# EAGLE schematic CNCMachineV1 (EAGLE 7.6.0)
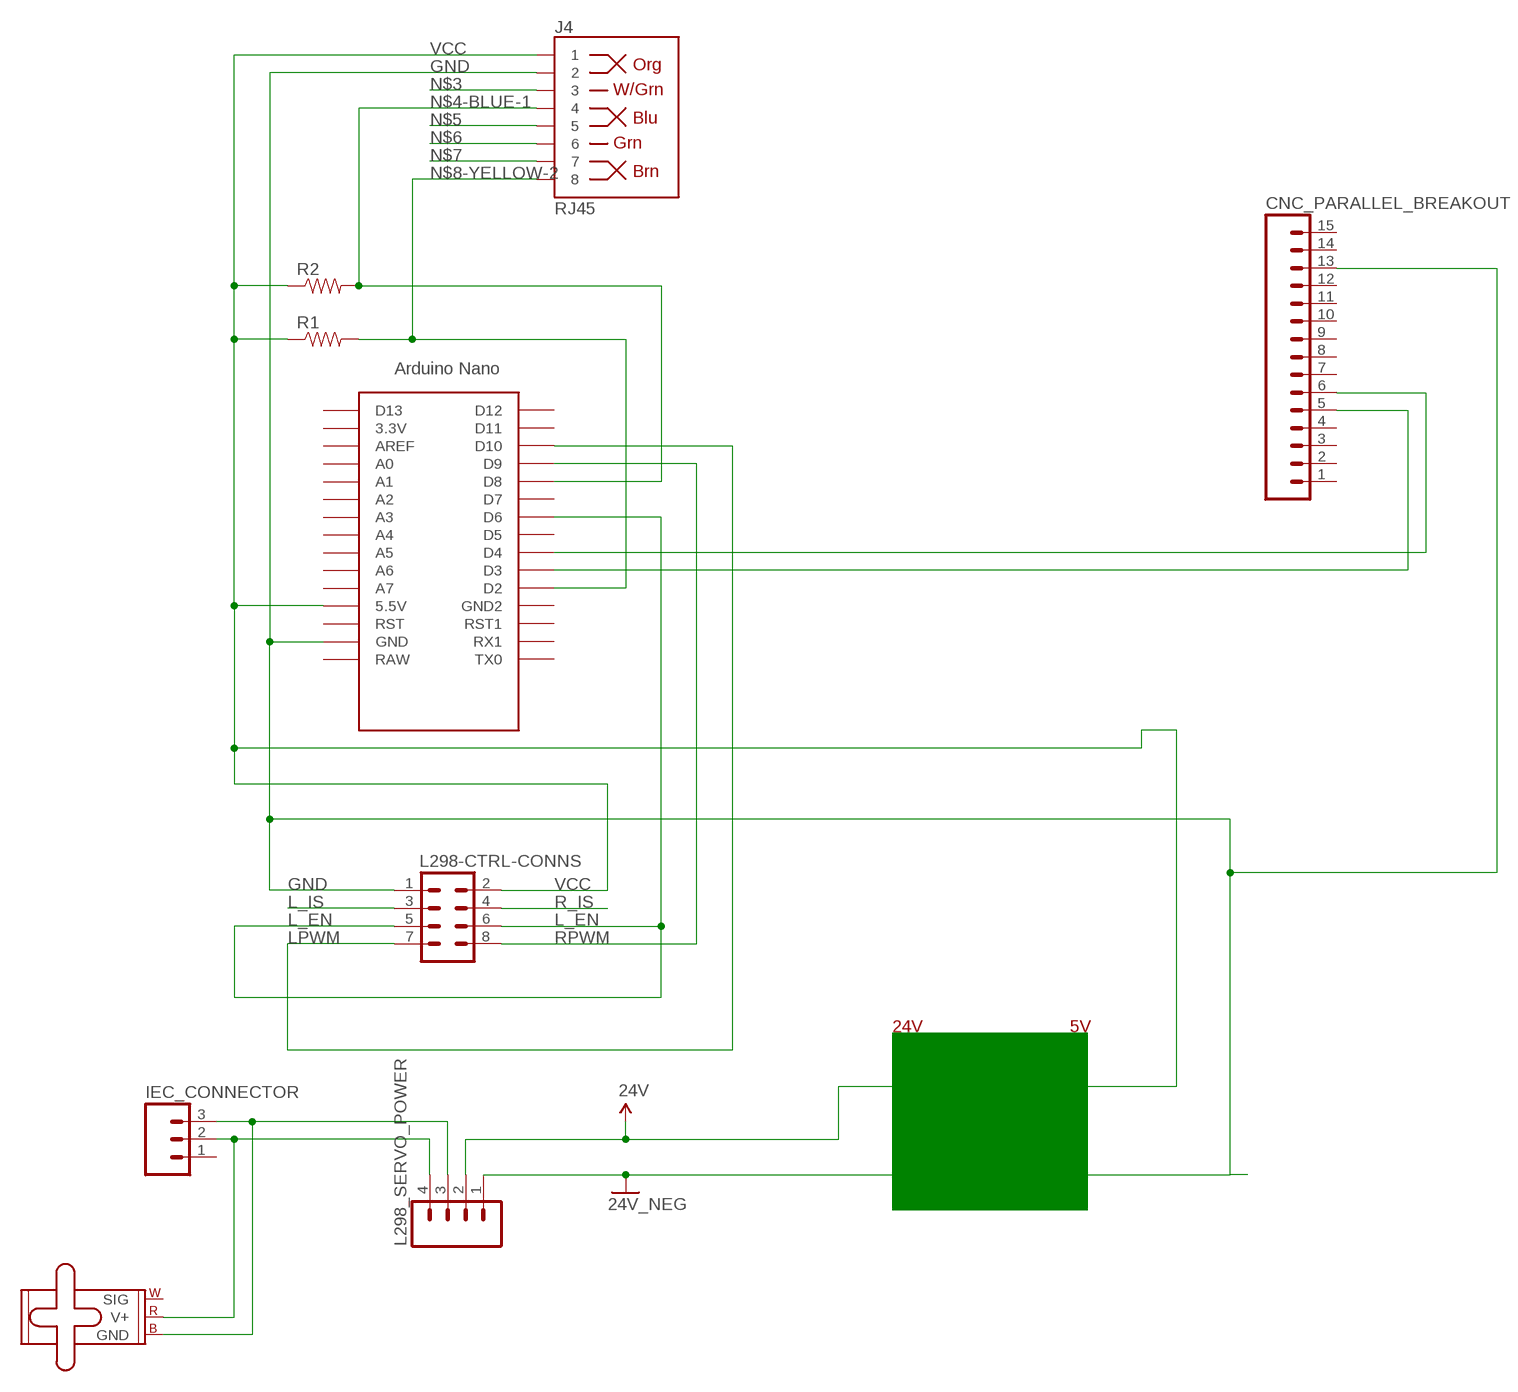
[diagram p0: schematic, sheet 1]

## Parts
CNC_PARALLEL_BREAKOUT  M15  [1X15]
IEC_CONNECTOR  M03-SCREW-5MM  [SCREWTERMINAL-5MM-3]
J4  RJ45  RJ45-8PTH  [RJ45-8]
L298-CTRL-CONNS  M04X2  [2X4]
L298_SERVO_POWER  M04SCREW  [SCREWTERMINAL-3.5MM-4]
M1  SMALL_SERVO  [1X03]
R1  RESISTORPTH-1/2W  [AXIAL-0.5]
R2  RESISTORPTH-1/2W  [AXIAL-0.5]
U$1  NANO  [NANO]

## Nets
GND: CNC_PARALLEL_BREAKOUT.13 J4.2 L298-CTRL-CONNS.1 L298_SERVO_POWER.1 U$1.GND ; supply symbol labelled 24V_NEG
L_EN: L298-CTRL-CONNS.5 L298-CTRL-CONNS.6 U$1.D6
L_IS: L298-CTRL-CONNS.3
LPWM: L298-CTRL-CONNS.7 U$1.D10
N$1: IEC_CONNECTOR.2 L298_SERVO_POWER.4 M1.2(V+)
N$2: IEC_CONNECTOR.3 L298_SERVO_POWER.3 M1.3(GND)
N$3: J4.3
N$4: CNC_PARALLEL_BREAKOUT.5 U$1.D3
N$4-BLUE-1: J4.4 R2.P$2 U$1.D8
N$5: J4.5
N$6: J4.6
N$7: J4.7
N$8: CNC_PARALLEL_BREAKOUT.6 U$1.D4
N$8-YELLOW-2: J4.8 R1.P$2 U$1.D2
R_IS: L298-CTRL-CONNS.4
RPWM: L298-CTRL-CONNS.8 U$1.D9
VCC: J4.1 L298-CTRL-CONNS.2 L298_SERVO_POWER.2 R1.P$1 R2.P$1 U$1.5V(5.5V) ; supply symbol labelled 24V
Unconnected: CNC_PARALLEL_BREAKOUT.1 CNC_PARALLEL_BREAKOUT.2 CNC_PARALLEL_BREAKOUT.3 CNC_PARALLEL_BREAKOUT.4 CNC_PARALLEL_BREAKOUT.7 CNC_PARALLEL_BREAKOUT.8 CNC_PARALLEL_BREAKOUT.9 CNC_PARALLEL_BREAKOUT.10 CNC_PARALLEL_BREAKOUT.11 CNC_PARALLEL_BREAKOUT.12 CNC_PARALLEL_BREAKOUT.14 CNC_PARALLEL_BREAKOUT.15 IEC_CONNECTOR.1 M1.1(SIG) U$1.3.3V U$1.A0 U$1.A1 U$1.A2 U$1.A3 U$1.A4 U$1.A5 U$1.A6 U$1.A7 U$1.AREF U$1.D5 U$1.D7 U$1.D11 U$1.D12 U$1.D13 U$1.GND1(GND2) U$1.ICSP1 U$1.ICSP2 U$1.ICSP3 U$1.ICSP4 U$1.ICSP5 U$1.ICSP6 U$1.RAW U$1.RST U$1.RST1 U$1.RX1 U$1.TX0

## Notes on the sheet
- 24V | 5V
- 24V | 24V | 24V | 24V | 24V

## Library data of the parts
CNC_PARALLEL_BREAKOUT = SparkFun-Connectors:M15: Header 15 Standard 15-pin 0.1" header. Use with straight break away headers (SKU : PRT-00116), right angle break away headers (PRT-00553), swiss pins (PRT-00743), machine pins (PRT-00117), and female headers (PRT-00115).
IEC_CONNECTOR = SparkFun-Connectors:M03: Header 3 Standard 3-pin 0.1" header. Use with straight break away headers (SKU : PRT-00116), right angle break away headers (PRT-00553), swiss pins (PRT-00743), machine pins (PRT-00117), and female headers (PRT-00115). Molex polarized connector foot print use with SKU : PRT-08232 with associated crimp pins and housings.; STOREFRONT_ID: PRT-08433
J4 = SparkFun-Connectors:RJ45-8: RJ45 Jack Simple RJ45, 8-pin connection - connector for common Cat5, Cat5e, and Cat6 Ethernet cables. Footprint not yet proven in production. Connector sku is PRT-00643; Breakout PCB sku is BOB-00716.; PROD_ID: CONN-08506
L298-CTRL-CONNS = SparkFun-Connectors:M04X2: .1" header, two rows of four.
L298_SERVO_POWER = SparkFun-Connectors:M04: Header 4 Standard 4-pin 0.1" header. Use with straight break away headers (SKU : PRT-00116), right angle break away headers (PRT-00553), swiss pins (PRT-00743), machine pins (PRT-00117), and female headers (PRT-00115). Molex polarized connector foot print use with SKU : PRT-08231 with associated crimp pins and housings. 1MM SMD Version SKU: PRT-10208; PROD_ID: Combine 2x8399
M1 = SparkFun-Electromechanical:SMALL_SERVO: Small servo motor This is the small servo used in the SIK. SKU: ROB-09065
R1 R2 = SparkFun-Passives:RESISTOR: Resistor Basic schematic elements and footprints for 0603, 1206, and PTH resistors.
U$1 = arduino:NANO: Arduino Nano